# EAGLE design hamilton (EAGLE 7.6.0)
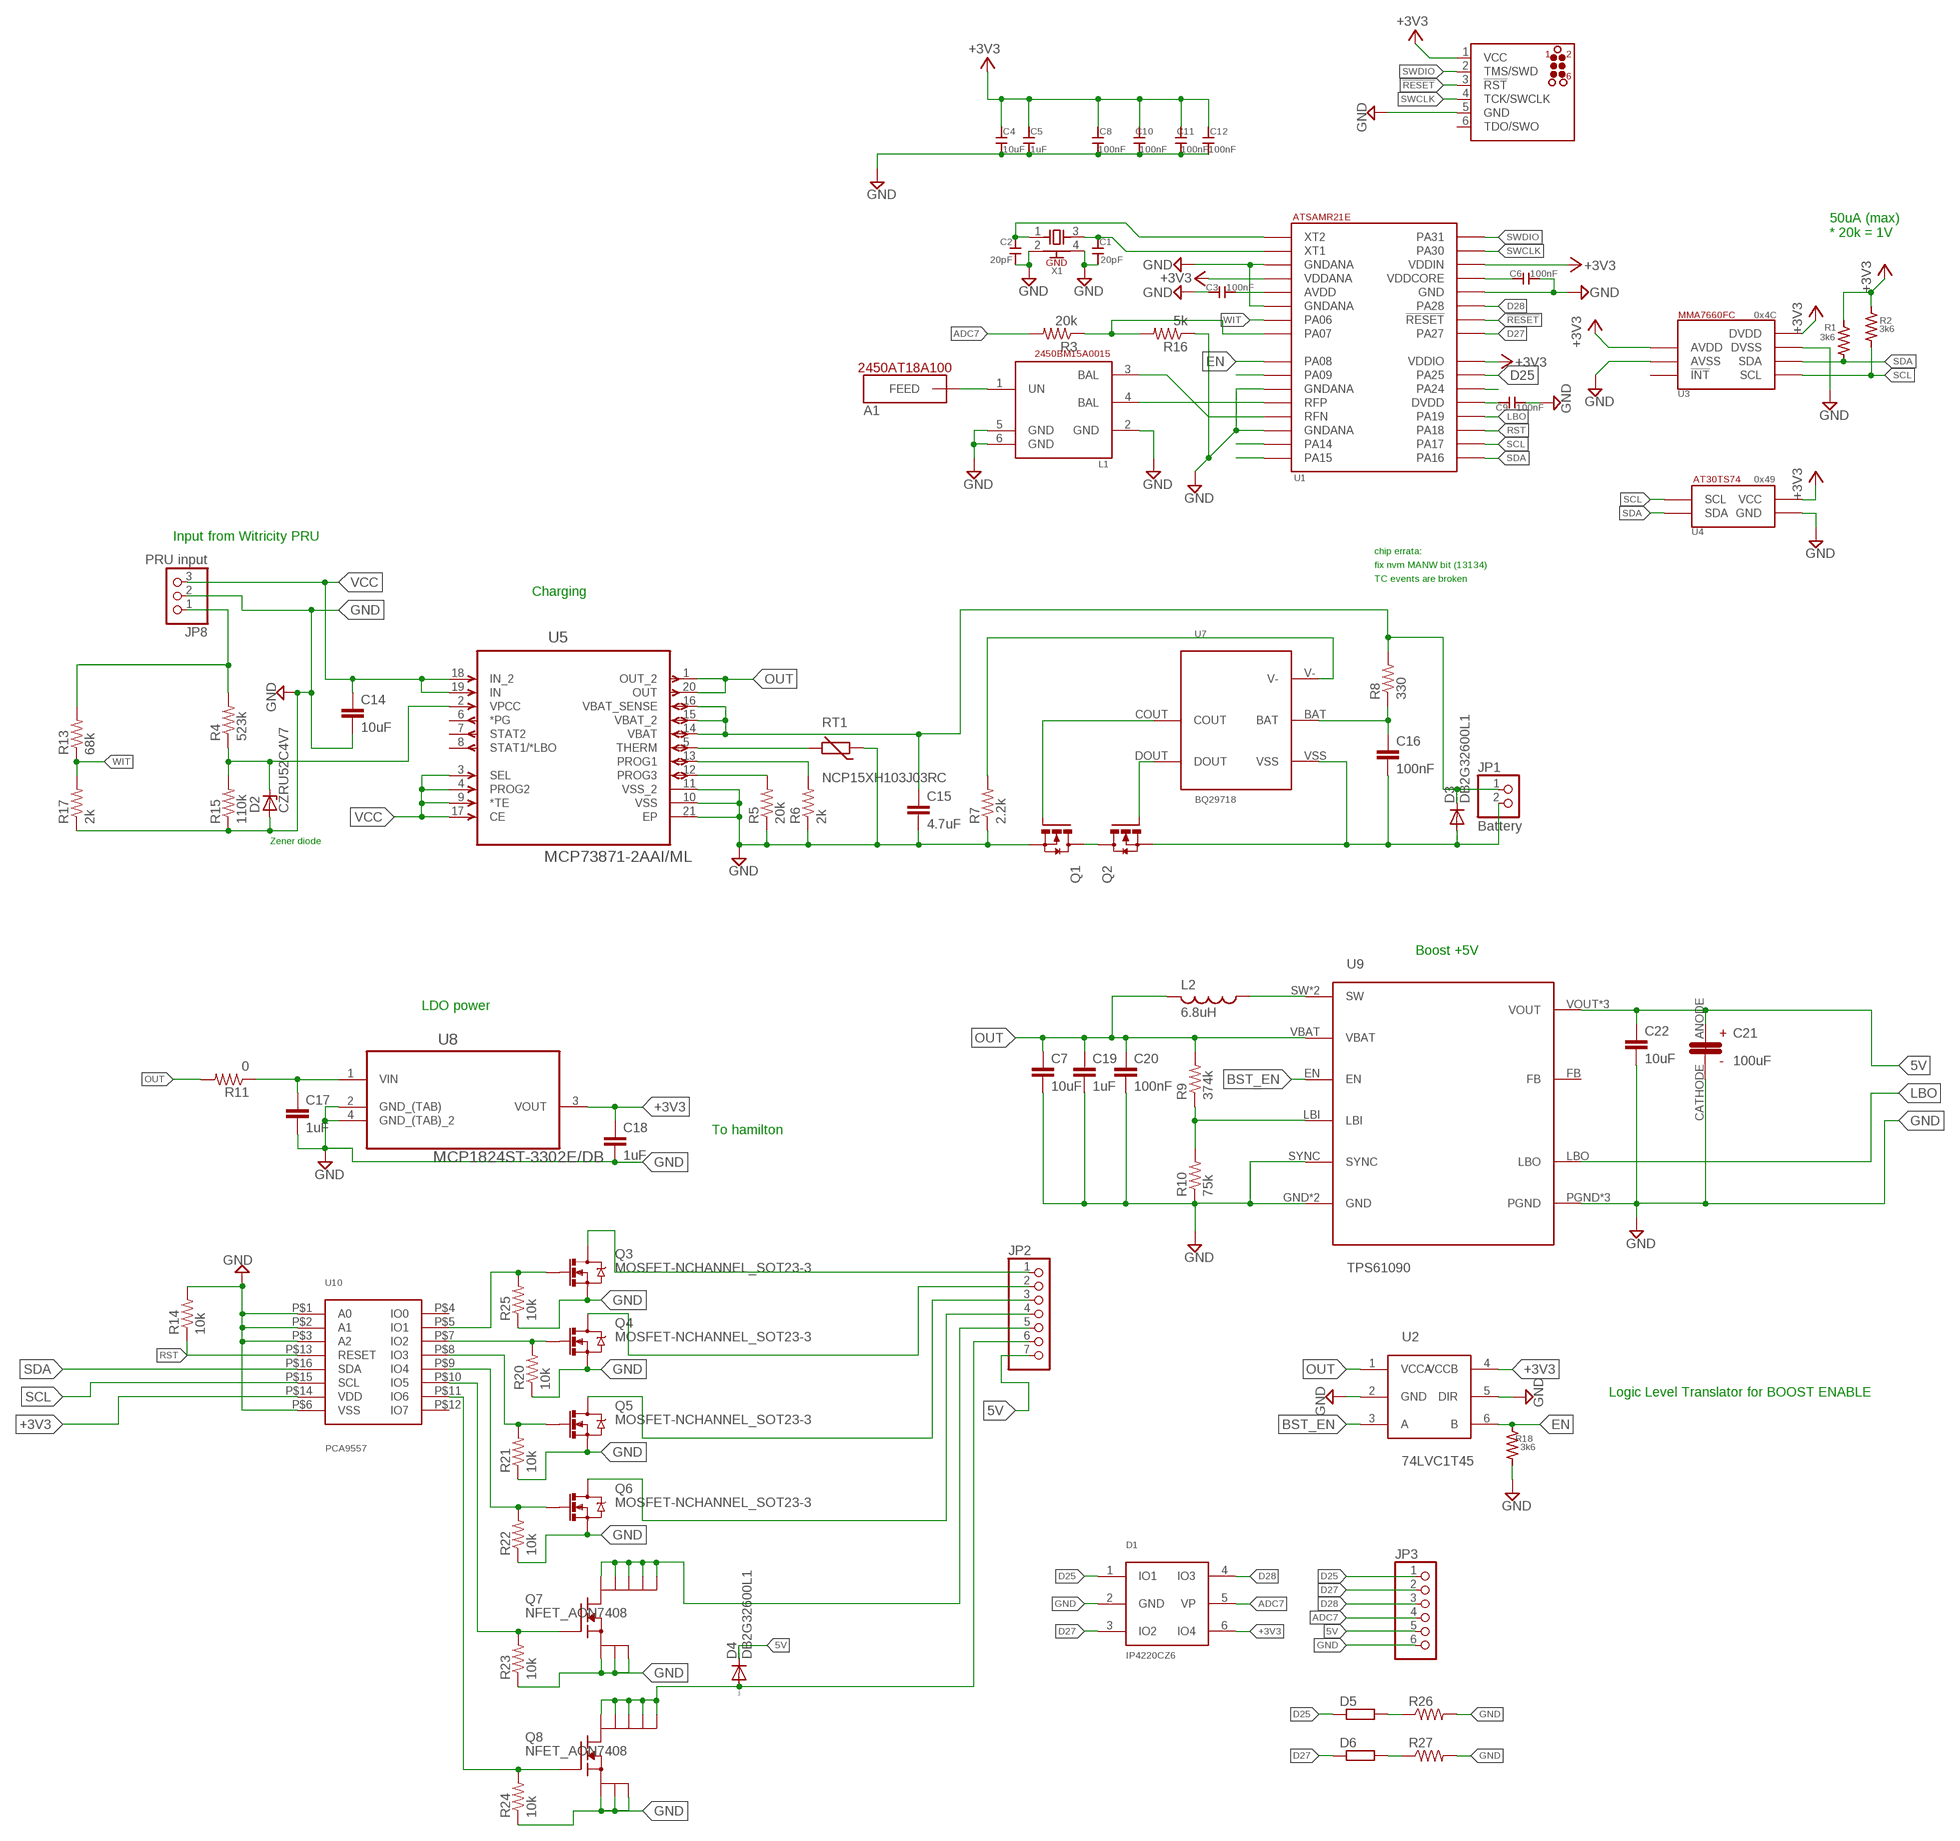
[diagram p0: schematic, sheet 1]

## Parts
A1  JOHANSON_ANTENNA2  [JOHANSON_ANTENNA2]
C1  20pF  0603_CAPACITORSMALL  [S0402]
C2  20pF  0603_CAPACITORSMALL  [S0402]
C3  100nF  0603_CAPACITOR0402  [C0402]
C4  10uF  0805_CAPACITOR  [0805]
C5  1uF  0603_CAPACITOR0402  [C0402]
C6  100nF  0603_CAPACITOR0402  [C0402]
C7  10uF  C-EUC0603  [C0603]
C8  100nF  0603_CAPACITOR0402  [C0402]
C9  100nF  0603_CAPACITOR0402  [C0402]
C10  100nF  0603_CAPACITOR0402  [C0402]
C11  100nF  0603_CAPACITOR0402  [C0402]
C12  100nF  0603_CAPACITOR0402  [C0402]
C14  10uF  C-EUC0603  [C0603]
C15  4.7uF  C-EUC0603  [C0603]
C16  100nF  C-EUC0603  [C0603]
C17  1uF  C-EUC0603  [C0603]
C18  1uF  C-EUC0603  [C0603]
C19  1uF  C-EUC0603  [C0603]
C20  100nF  C-EUC0603  [C0603]
C21  100uF  T491C686K010AT  [6032]
C22  10uF  C-EUC0603  [C0603]
D1  IP4220CZ6  [SOT457]
D2  CZRU52C4V7  [R0603]
D3  DB2G32600L1  [R0402]
D4  DB2G32600L1  [R0402]
D5  R-EU_R0603  [R0603]
D6  R-EU_R0603  [R0603]
JP1  Battery  PINHD-1X2  [1X02]
JP2  PINHD-1X7  [1X07]
JP3  PINHD-1X6  [1X06]
JP8  PRU input  PINHD-1X3  [1X03]
L1  BALUN_JOHANSON  [BALUN_JOHANSON]
L2  6.8uH  L-744787068  [2-SMD-7.8-7-5]
Q1  CSD16301Q2  [6-SMD]
Q2  CSD16301Q2  [6-SMD]
Q3  MOSFET-NCHANNEL_SOT23-3  [SOT23-3]
Q4  MOSFET-NCHANNEL_SOT23-3  [SOT23-3]
Q5  MOSFET-NCHANNEL_SOT23-3  [SOT23-3]
Q6  MOSFET-NCHANNEL_SOT23-3  [SOT23-3]
Q7  NFET_AON7408  [VDFN3X38L]
Q8  NFET_AON7408  [VDFN3X38L]
R1  3k6  0603_RESISTORSMALL  [S0402]
R2  3k6  0603_RESISTORSMALL  [S0402]
R3  20k  R-US_R0402  [R0402]
R4  523k  R-US_R0603  [R0603]
R5  20k  R-US_R0603  [R0603]
R6  2k  R-US_R0603  [R0603]
R7  2.2k  R-US_R0603  [R0603]
R8  330  R-US_R0603  [R0603]
R9  374k  R-US_R0603  [R0603]
R10  75k  R-US_R0603  [R0603]
R11  0  R-US_R0603  [R0603]
R13  68k  R-US_R0402  [R0402]
R14  10k  R-US_R0603  [R0603]
R15  110k  R-US_R0603  [R0603]
R16  5k  R-US_R0402  [R0402]
R17  2k  R-US_R0402  [R0402]
R18  3k6  0603_RESISTORSMALL  [S0402]
R20  10k  R-US_R0402  [R0402]
R21  10k  R-US_R0402  [R0402]
R22  10k  R-US_R0402  [R0402]
R23  10k  R-US_R0402  [R0402]
R24  10k  R-US_R0402  [R0402]
R25  10k  R-US_R0402  [R0402]
R26  R-US_R0402  [R0402]
R27  R-US_R0402  [R0402]
RT1  NCP15XH103J03RC  [CT/CN0402]
U1  SAMR21  [QFN32]
U2  74LVC1T45  [SOT891]
U3  MMA7660FC  [MMA7660]
U4  AT30TS74  [4WLCSP]
U5  MCP73871-2AAI/ML  [QFN50P400X400X100-21N]
U7  BQ29718  [6-WFDFN]
U8  MCP1824ST-3302E/DB  [SOT230P700X180-4N]
U9  TPS61090  [QFN-16]
U10  PCA9557  [SOT629-1]
U$1  JLINK_CONNECT  [TC2030-MCP-NL]
X1  XTAL  [XTAL]

## Nets
5V: C21.ANODE C22.1 D4.C JP2.7 JP3.5 U9.VOUT U9.VOUT_2(VOUT) U9.VOUT_3(VOUT)
!RESET!: U1.26(!RESET!) U$1.3(!RST!)
+3V3: C4.2 C5.2 C8.1 C10.1 C11.1 C12.1 C18.1 D1.6(IO4) R1.P$2 R2.P$2 U1.4(VDDANA) U1.24(VDDIO) U1.30(VDDIN) U2.4(VCCB) U3.3(AVDD) U3.9(DVDD) U4.A1(VCC) U8.3(VOUT) U10.P$14(VDD) U$1.1(VCC)
ADC7: D1.5(VP) JP3.4 R3.2
BST_EN: U2.3(A) U9.EN
D25: D1.1(IO1) D5.1 JP3.1 U1.23(PA25)
D27: D1.3(IO2) D6.1 JP3.2 U1.25(PA27)
D28: D1.4(IO3) JP3.3 U1.27(PA28)
EN: R18.P$2 U1.9(PA08) U2.6(B)
GND: C1.P$1 C2.P$1 C3.2 C4.1 C5.1 C6.1 C7.2 C8.2 C9.1 C10.2 C11.2 C12.2 C14.2 C15.2 C17.2 C18.2 C19.2 C20.2 C21.CATHODE C22.2 D1.2(GND) D2.A JP3.6 JP8.2 L1.2(GND) L1.5(GND) L1.6(GND) Q1.S_1(S) Q1.S_2(S) Q3.2(S) Q4.2(S) Q5.2(S) Q6.2(S) Q7.1(S) Q7.2(S) Q7.3(S) Q8.1(S) Q8.2(S) Q8.3(S) R5.1 R6.1 R7.1 R10.1 R14.2 R15.1 R16.1 R17.1 R18.P$1 R20.1 R21.1 R22.1 R23.1 R24.1 R25.1 R26.2 R27.2 RT1.1 U1.3(GNDANA) U1.6(GNDANA) U1.11(GNDANA) U1.14(GNDANA) U1.28(GND) U2.2(GND) U2.5(DIR) U3.4(AVSS) U3.8(DVSS) U4.A2(GND) U5.10(VSS) U5.11(VSS_2) U5.21(EP) U8.2(GND_(TAB)) U8.4(GND_(TAB)_2) U9.GND U9.P$17(GND) U9.PGND U9.PGND_2(PGND) U9.PGND_3(PGND) U9.SYNC U10.P$1(A0) U10.P$2(A1) U10.P$3(A2) U10.P$6(VSS) U$1.5(GND) X1.2(GND) X1.4(GND)
LBO: U1.20(PA19) U9.LBO
LDOIN: C17.1 R11.1 U8.1(VIN)
N$1: JP8.1 R4.2 R13.2
N$2: L1.3(BAL) U1.13(RFN)
N$3: A1.FEED L1.1(UN)
N$4: C2.P$2 U1.1(XT2) X1.1(X1)
N$5: C6.2 U1.29(VDDCORE)
N$6: C3.1 U1.5(AVDD)
N$7: C1.P$2 U1.2(XT1) X1.3(X2)
N$9: R3.1 R16.2 U1.8(PA07)
N$10: C9.2 U1.21(DVDD)
N$11: JP2.5 Q7.5(D) Q7.6(D) Q7.7(D) Q7.8(D) Q7.PAD(D)
N$12: U1.10(PA09)
N$13: L1.4(BAL) U1.12(RFP)
N$14: JP2.1 Q3.3(D)
N$15: U1.15(PA14)
N$16: R5.2 U5.12(PROG3)
N$17: U1.16(PA15)
N$18: R6.2 U5.13(PROG1)
N$19: RT1.2 U5.5(THERM)
N$20: R7.2 U7.V-
N$21: C16.1 R8.1 U7.BAT
N$22: Q1.G U7.COUT
N$23: Q2.G U7.DOUT
N$24: Q1.D_1(D) Q1.D_2(D) Q1.D_3(D) Q1.D_4(D) Q1.D_5(D) Q2.D_1(D) Q2.D_2(D) Q2.D_3(D) Q2.D_4(D) Q2.D_5(D)
N$25: C16.2 D3.A JP1.2 Q2.S_1(S) Q2.S_2(S) U7.VSS
N$26: D4.A JP2.6 Q8.5(D) Q8.6(D) Q8.7(D) Q8.8(D) Q8.PAD(D)
N$27: L2.P$1 U9.SW U9.SW_2(SW)
N$28: R9.1 R10.2 U9.LBI
N$30: Q3.1(G) R25.2 U10.P$5(IO1)
N$31: Q4.1(G) R20.2 U10.P$7(IO2)
N$32: Q5.1(G) R21.2 U10.P$8(IO3)
N$33: Q6.1(G) R22.2 U10.P$9(IO4)
N$34: JP2.2 Q4.3(D)
N$35: JP2.3 Q5.3(D)
N$36: JP2.4 Q6.3(D)
N$37: C15.1 D3.C JP1.1 R8.2 U5.14(VBAT) U5.15(VBAT_2) U5.16(VBAT_SENSE)
N$38: D5.2 R26.1
N$39: D6.2 R27.1
N$40: Q7.4(G) R23.2 U10.P$10(IO5)
N$41: Q8.4(G) R24.2 U10.P$11(IO6)
N$42: U1.22(PA24)
OUT: C7.1 C19.1 C20.1 L2.P$2 R9.2 R11.2 U2.1(VCCA) U5.1(OUT_2) U5.20(OUT) U9.VBAT
RECT: D2.C R4.1 R15.2 U5.2(VPCC)
RST: R14.1 U1.19(PA18) U10.P$13(RESET)
SCL: R2.P$1 U1.18(PA17) U3.6(SCL) U4.B2(SCL) U10.P$15(SCL)
SDA: R1.P$1 U1.17(PA16) U3.7(SDA) U4.B1(SDA) U10.P$16(SDA)
SWCLK: U1.31(PA30) U$1.4(TCK/SWCLK)
SWDIO: U1.32(PA31) U$1.2(TMS/SWD)
VCC: C14.1 JP8.3 U5.3(SEL) U5.4(PROG2) U5.9(*TE) U5.17(CE) U5.18(IN_2) U5.19(IN)
WIT: R13.1 R17.2 U1.7(PA06)
Unconnected: U3.5(!INT!) U5.6(*PG) U5.7(STAT2) U5.8(STAT1/*LBO) U9.FB U10.P$4(IO0) U10.P$12(IO7) U$1.6(TDO/SWO)

## Notes on the sheet
- 50uA (max) 
  * 20k = 1V
- X1
- 0x4C
- 0x49
- Input from Witricity PRU
- chip errata:
- fix nvm MANW bit (13134)
- TC events are broken
- Charging
- Zener diode
- Boost +5V
- LDO power
- To hamilton
- Logic Level Translator for BOOST ENABLE

## Library data of the parts
A1 = storm:JOHANSON_ANTENNA2
C1-C3 C5 C6 C8-C12 = storm:0603_CAPACITOR
C4 = storm:0805_CAPACITOR
C7 C14-C20 C22 = resistor:C-EU: CAPACITOR, European symbol
C21 = insole:T491C686K010AT
D1 = insole:IP4220CZ6
D2 = insole:CZRU52C4V7
D3 D4 = insole:DB2G32600L1
D5 D6 = resistor:R-EU_: RESISTOR, European symbol
JP1 = pinhead:PINHD-1X2: PIN HEADER
JP2 = pinhead:PINHD-1X7: PIN HEADER
JP3 = pinhead:PINHD-1X6: PIN HEADER
JP8 = pinhead:PINHD-1X3: PIN HEADER
L1 = storm:BALUN_JOHANSON
L2 = insole:L-744787068
Q1 Q2 = insole:CSD16301Q2
Q3-Q6 = Simplex-DiscreteSemi:MOSFET-NCHANNEL: Generic N-channel mosfet
Q7 Q8 = fets:NFET_AON7408
R1 R2 R18 = storm:0603_RESISTOR
R3-R11 R13-R17 R20-R27 = resistor:R-US_: RESISTOR, American symbol
RT1 = varistor:NCP15XH103J03RC
U1 = storm:SAMR21
U2 = insole:74LVC1T45
U3 = storm:MMA7660FC
U4 = storm:AT30TS74
U5 = Microchip_By_element14_Batch_1:MCP73871-2AAI/ML: IC, BATTERY CHARGER, 1A; MPN: MCP73871-2AAI/ML; OC_FARNELL: 1642487; OC_NEWARK: 54M4955; PACKAGE: QFN-20; SUPPLIER: Microchip
U7 = insole:BQ29718
U8 = Microchip_By_element14_Batch_1:MCP1824ST-3302E/DB: IC, LDO VOLT REG, 3.3V, 0.3A,; MPN: MCP1824ST-3302E/DB; OC_FARNELL: 1578379; OC_NEWARK: 05N1293; PACKAGE: SOT-223-3; SUPPLIER: Microchip
U9 = insole:TPS61090
U10 = insole:PCA9557
U$1 = storm:JLINK_CONNECT
X1 = storm:XTAL

## Board
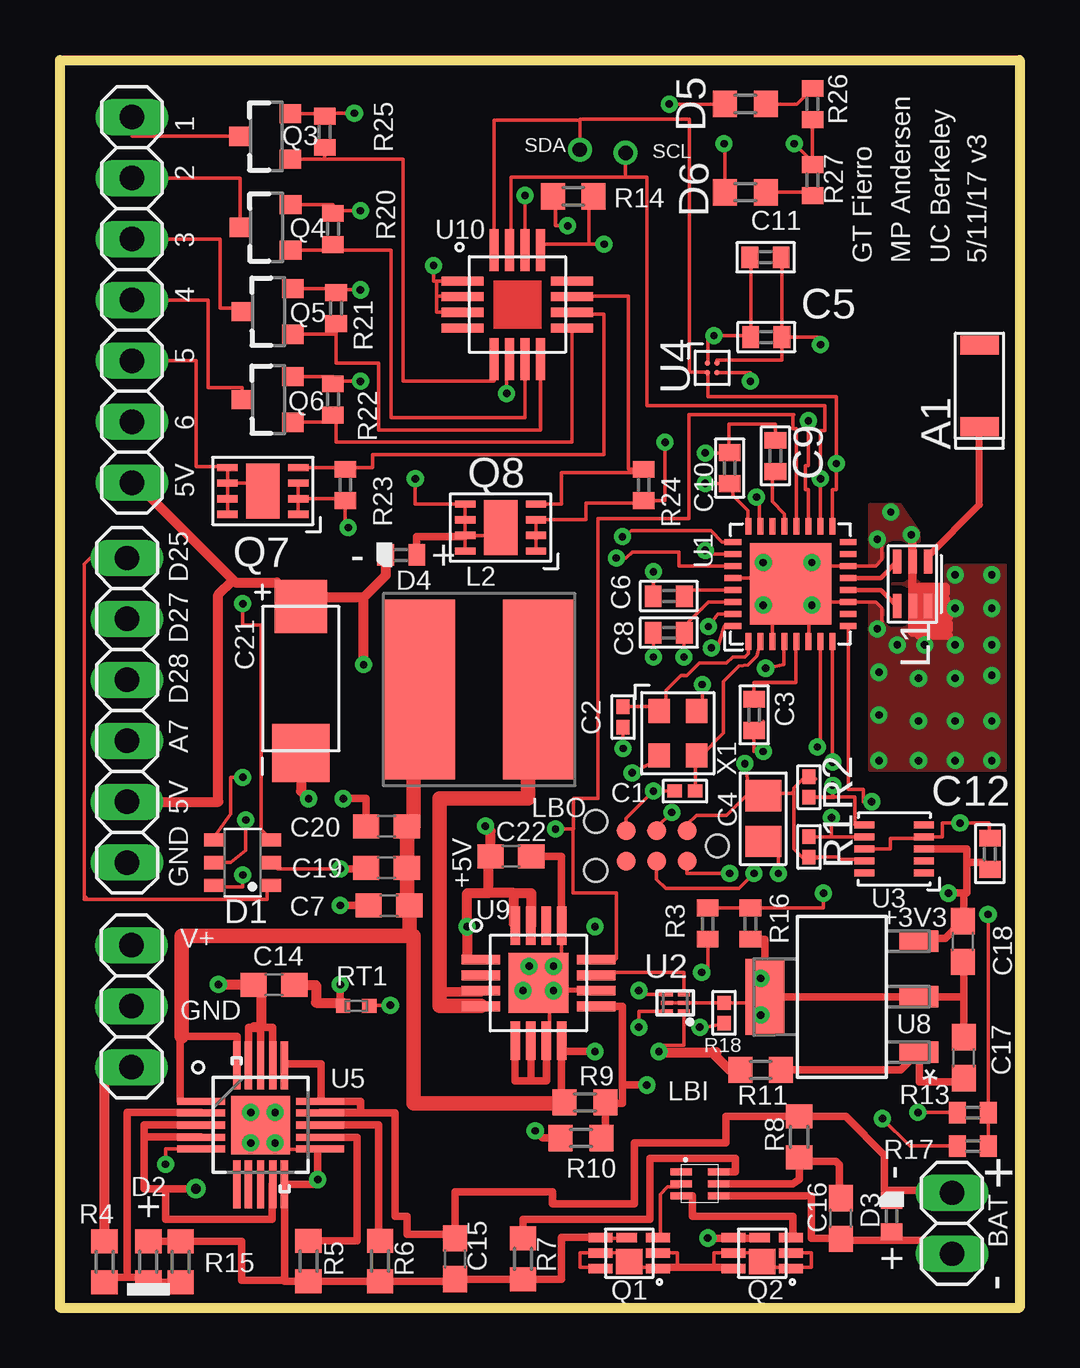
[diagram p1: board, top side]
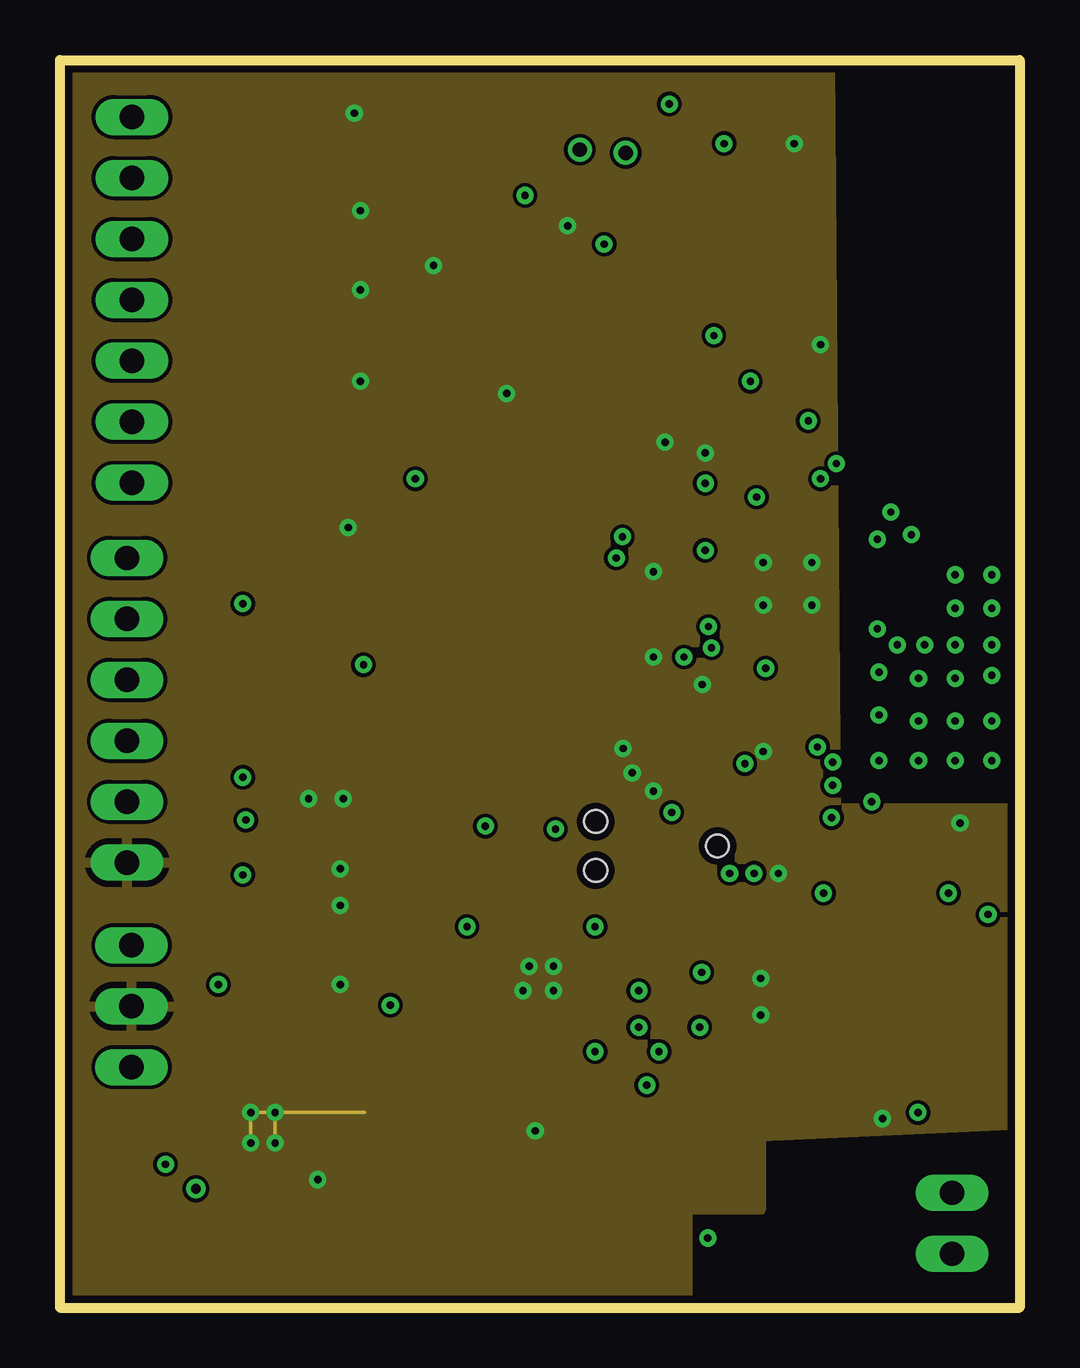
[diagram p2: board, inner layer Route2]
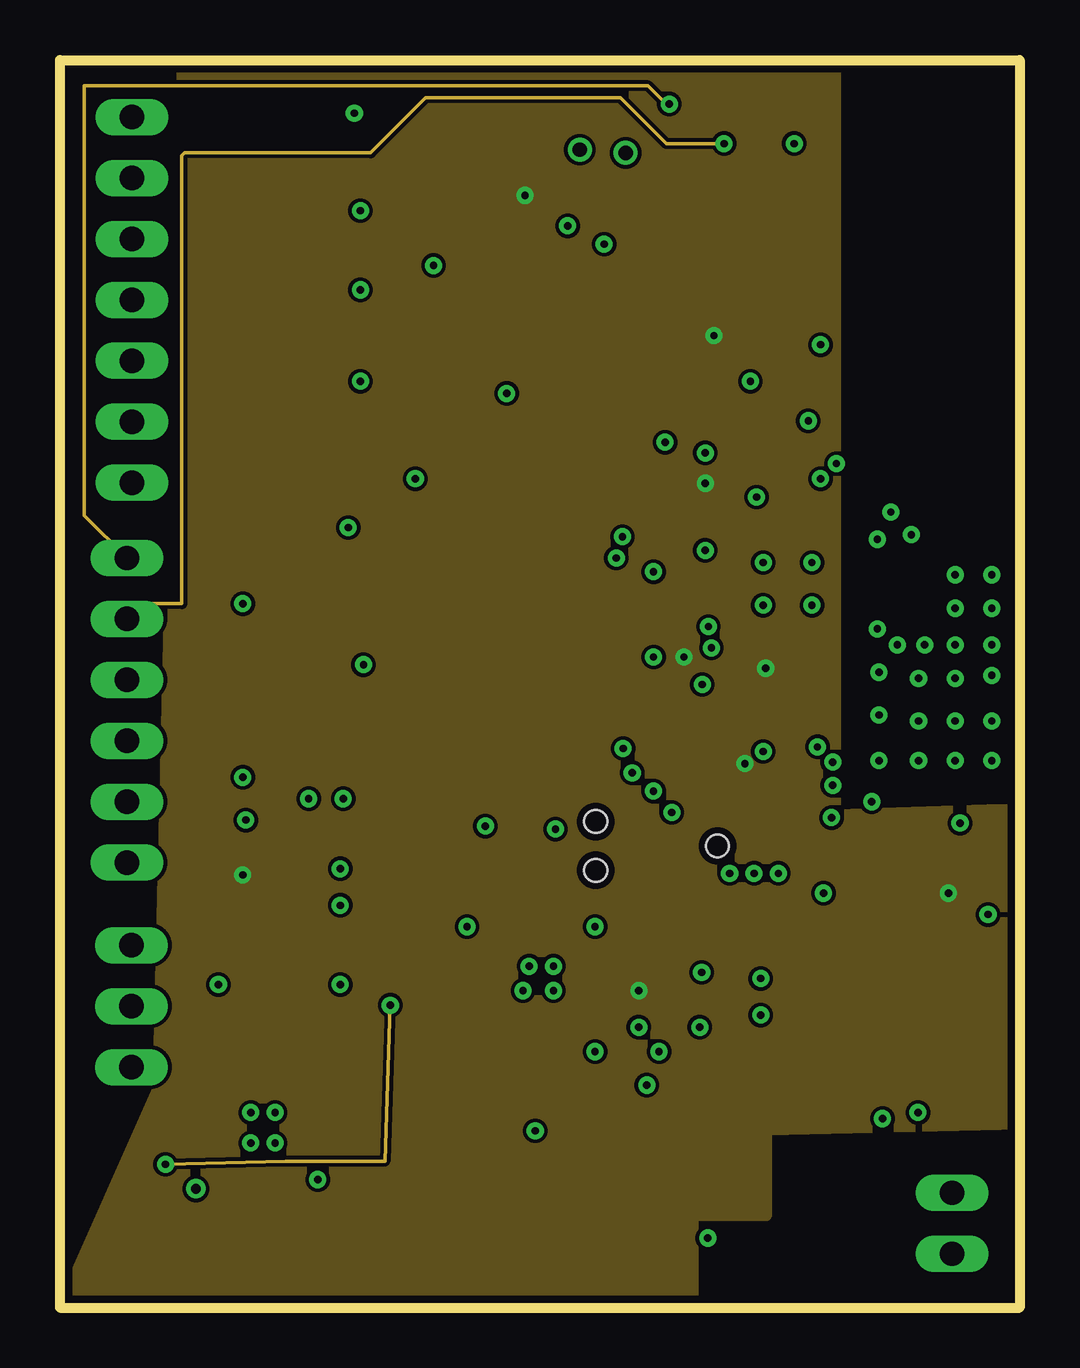
[diagram p3: board, inner layer Route15]
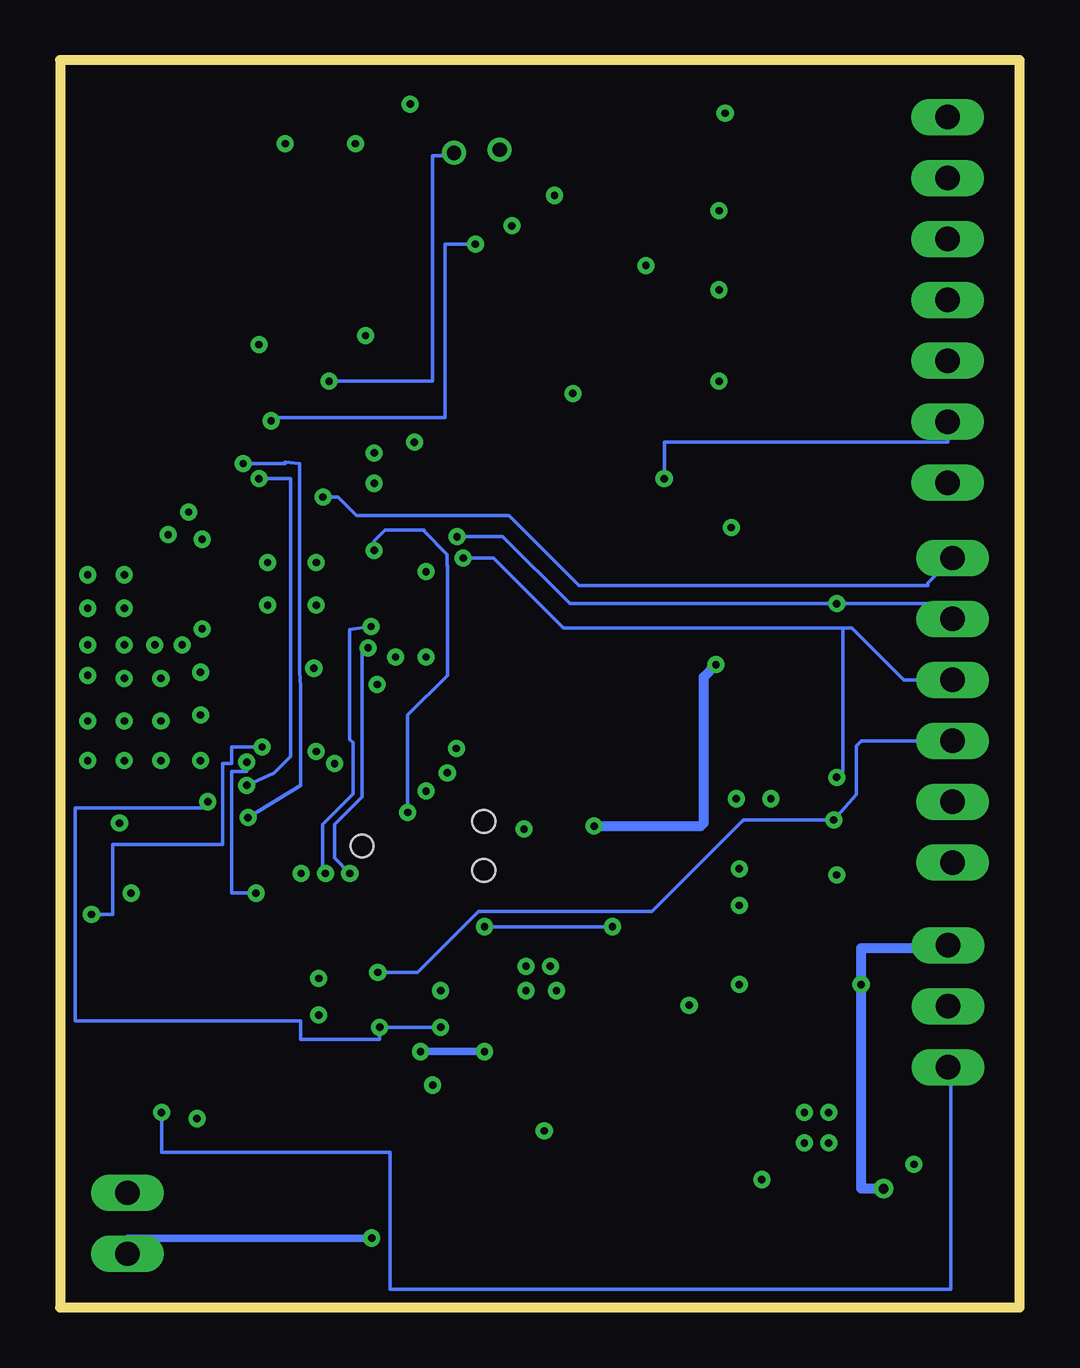
[diagram p4: board, bottom side, seen from below]

Size 40 x 52 mm. Coordinates in mm from the lower left corner, seen from the top.
Outline: 0,0 40,0 40,52 0,52 0,0
Copper layers (1*2*15*16): Top 0.035mm / dielectric 1.5mm / Route2 0.035mm / dielectric 0.15mm / Route15 0.035mm / dielectric 0.2mm / Bottom 0.035mm
Design rules "default *": minimum track width 6mil, minimum drill 12mil, track to track 6mil, track to pad 6mil, pad to pad 6mil, via to via 6mil, smd to smd 6mil, copper to edge 12mil, drill to drill 8mil, minimum pad ring 10mil, minimum via ring 8mil, stop-mask expansion 4mil, vias tented up to drill 12mil, thermal gap 10mil

### Footprints (pad centres in the part's own frame; a part is rotated, then mirrored left to right if it is on the bottom)
JOHANSON_ANTENNA2 = smd 0.8 x 1.6: FEED -1.7,0; NC 1.7,0
S0402 = smd 0.6 x 0.55: P$1 0,0; P$2 0.85,0
C0402 = smd 0.7 x 0.9: 1 -0.65,0; 2 0.65,0
0805 = smd 1.3 x 1.5: 1 -0.95,0; 2 0.95,0
C0603 = smd 1.1 x 1: 1 -0.85,0; 2 0.85,0
6032 = smd 2.2 x 2.2: ANODE 3,0 | smd 2.4 x 2.4: CATHODE -3.1,0
SOT457 = smd 0.55 x 0.8: 1 -0.95,-1.2; 2 0,-1.2; 3 0.95,-1.2; 4 0.95,1.2; 5 0,1.2; 6 -0.95,1.2
R0603 = smd 1 x 1.1: A 0.85,0; C -0.85,0
R0402 = smd 0.7 x 0.9: A -0.65,0; C 0.65,0
R0603' = smd 1 x 1.1: 1 -0.85,0; 2 0.85,0
1X02 = drill 1.016 long: 1 -1.27,0; 2 1.27,0
1X07 = drill 1.016 long: 1 -7.62,0; 2 -5.08,0; 3 -2.54,0; 4 0,0; 5 2.54,0; 6 5.08,0; 7 7.62,0
1X06 = drill 1.016 long: 1 -6.35,0; 2 -3.81,0; 3 -1.27,0; 4 1.27,0; 5 3.81,0; 6 6.35,0
1X03 = drill 1.016 long: 1 -2.54,0; 2 0,0; 3 2.54,0
BALUN_JOHANSON = smd 1 x 0.35: 1 -0.925,0.65; 2 -0.925,0; 3 -0.925,-0.65; 4 0.925,-0.65; 5 0.925,0; 6 0.925,0.65
2-SMD-7.8-7-5 = smd 7.5 x 3: P$1 0,2.5; P$2 0,-2.5
6-SMD = smd 0.4 x 1: D_1 -0.65,-1.2; D_2 0,-1.2; D_3 0,1.2; D_4 -0.65,1.2; G 0.65,-1.2; S_1 0.65,1.2 | smd 1.05 x 1.1: D_5 -0.35,0 | smd 0.4 x 0.85: S_2 0.65,0.1
SOT23-3 = smd 0.8 x 0.9: 1 -0.95,-1; 2 0.95,-1; 3 0,1.1
VDFN3X38L = smd 0.3 x 0.85: 1 -0.975,-1.475; 2 -0.325,-1.475; 3 0.325,-1.475; 4 0.975,-1.475; 5 0.975,1.475; 6 0.325,1.475; 7 -0.325,1.475; 8 -0.975,1.475 | smd 2.3 x 1.4: PAD 0,0
R0402' = smd 0.7 x 0.9: 1 -0.65,0; 2 0.65,0
CT/CN0402 = smd 0.6 x 0.6: 1 -0.55,0; 2 0.55,0
QFN32 = smd 0.7 x 0.25: 1 -2.4,1.75; 2 -2.4,1.25; 3 -2.4,0.75; 4 -2.4,0.25; 5 -2.4,-0.25; 6 -2.4,-0.75; 7 -2.4,-1.25; 8 -2.4,-1.75; 17 2.4,-1.75; 18 2.4,-1.25; 19 2.4,-0.75; 20 2.4,-0.25; 21 2.4,0.25; 22 2.4,0.75; 23 2.4,1.25; 24 2.4,1.75 | smd 0.25 x 0.7: 9 -1.75,-2.4; 10 -1.25,-2.4; 11 -0.75,-2.4; 12 -0.25,-2.4; 13 0.25,-2.4; 14 0.75,-2.4; 15 1.25,-2.4; 16 1.75,-2.4; 25 1.75,2.4; 26 1.25,2.4; 27 0.75,2.4; 28 0.25,2.4; 29 -0.25,2.4; 30 -0.75,2.4; 31 -1.25,2.4; 32 -1.75,2.4 | smd 3.4 x 3.4: PAD 0,0
SOT891 = smd 0.15 x 0.5: 1 -0.35,-0.35; 2 0,-0.35; 3 0.35,-0.35; 4 0.35,0.35; 5 0,0.35; 6 -0.35,0.35
MMA7660 = smd 0.3 x 0.825: 1 -1,-1.24; 2 -0.5,-1.24; 3 0,-1.24; 4 0.5,-1.24; 5 1,-1.24; 6 1,1.24; 7 0.5,1.24; 8 0,1.24; 9 -0.5,1.24; 10 -1,1.24
4WLCSP = smd 0.235 x 0.235: A1 -0.2,0.2; A2 0.2,0.2; B1 -0.2,-0.2; B2 0.2,-0.2
QFN50P400X400X100-21N = smd 2 x 0.3: 1 -2.48,0.991; 2 -2.48,0.508; 3 -2.48,0; 4 -2.48,-0.508; 5 -2.48,-0.991; 11 2.48,-0.991; 12 2.48,-0.508; 13 2.48,0; 14 2.48,0.508; 15 2.48,0.991 | smd 0.3 x 2: 6 -0.991,-2.48; 7 -0.508,-2.48; 8 0,-2.48; 9 0.508,-2.48; 10 0.991,-2.48; 16 0.991,2.48; 17 0.508,2.48; 18 0,2.48; 19 -0.508,2.48; 20 -0.991,2.48 | smd 2.443 x 2.443: 21 0,0
6-WFDFN = smd 0.9 x 0.28: BAT 0.78,0; COUT -0.78,0; DOUT -0.78,-0.5; NC -0.78,0.5; V- 0.78,0.5; VSS 0.78,-0.5
SOT230P700X180-4N = smd 1.626 x 0.889: 1 -3.2,2.311; 2 -3.2,0; 3 -3.2,-2.311 | smd 1.626 x 3.175: 4 3.2,0
QFN-16 = smd 1.6 x 0.4: EN 2.4,0.32; LBI 2.4,-0.97; LBO 2.4,0.97; NC -2.4,0.32; SW -2.4,-0.97; SW_2 -2.4,-0.32; SYNC 2.4,-0.32; VOUT_3 -2.4,0.97 | smd 0.4 x 1.6: FB 0.32,2.4; GND 0.97,2.4; PGND 0.32,-2.4; PGND_2 -0.32,-2.4; PGND_3 -0.97,-2.4; VBAT 0.97,-2.4; VOUT -0.97,2.4; VOUT_2 -0.32,2.4 | smd 2.5 x 2.5: P$17 0,0
SOT629-1 = smd 1.75 x 0.38: P$1 -2.275,0.975; P$2 -2.275,0.325; P$3 -2.275,-0.325; P$4 -2.275,-0.975; P$9 2.275,-0.975; P$10 2.275,-0.325; P$11 2.275,0.325; P$12 2.275,0.975 | smd 0.38 x 1.75: P$5 -0.975,-2.275; P$6 -0.325,-2.275; P$7 0.325,-2.275; P$8 0.975,-2.275; P$13 0.975,2.275; P$14 0.325,2.275; P$15 -0.325,2.275; P$16 -0.975,2.275
TC2030-MCP-NL = smd 0.787 x 0.787: 1 1.27,-0.635; 2 1.27,0.635; 3 2.54,-0.635; 4 2.54,0.635; 5 3.81,-0.635; 6 3.81,0.635 | hole 0.95: 0,0; 5.08,-1.016; 5.08,1.016
XTAL = smd 1 x 0.9: 1 -0.925,-0.775; 2 0.925,-0.775; 3 0.925,0.775; 4 -0.925,0.775

### Placement (x,y rotation side)
A1  38.33,38.42 90 top
C1  25.63,21.53 0 top
C2  23.47,24.19 90 top
C3  28.93,24.7 270 top
C4  29.32,20.38 90 top
C5  29.44,40.45 180 top
C6  25.38,29.65 0 top
C7  13.72,16.76 180 top
C8  25.38,28.13 180 top
C9  29.82,35.5 270 top
C10  27.92,34.99 90 top
C11  29.42,43.78 0 top
C12  38.76,18.91 90 top
C14  8.92,13.44 0 top
C15  16.46,2.04 270 top
C16  32.54,3.71 270 top
C17  37.67,10.41 90 top
C18  37.63,15.26 270 top
C19  13.61,18.33 180 top
C20  13.61,20.06 180 top
C21  10.05,26.22 90 top
C22  18.8,18.81 0 top
D1  7.62,18.54 90 top
D2  3.68,1.91 90 top
D3  34.67,3.81 90 top
D4  14.22,31.37 180 top
D5  [R0603']  28.57,50.16 0 top
D6  [R0603']  28.57,46.48 0 top
JP1  37.18,3.51 270 top
JP2  3,42 270 top
JP3  2.79,24.89 270 top
JP8  2.98,12.56 90 top
L1  35.54,30.16 270 top
L2  17.47,25.76 270 top
Q1  23.73,2.27 90 top
Q2  29.27,2.27 90 top
Q3  8.6,48.81 90 top
Q4  8.62,45.02 90 top
Q5  8.7,41.51 90 top
Q6  8.7,37.85 90 top
Q7  8.46,34.04 90 top
Q8  18.37,32.51 90 top
R1  31.22,19.62 270 top
R2  31.22,21.27 90 top
R3  20k  [R0402']  27,16 270 top
R4  523k  [R0603']  1.86,1.91 90 top
R5  20k  [R0603']  10.36,1.94 90 top
R6  2k  [R0603']  13.34,1.94 90 top
R7  2.2k  [R0603']  19.3,2.03 90 top
R8  330  [R0603']  30.81,7.11 90 top
R9  374k  [R0603']  21.89,8.55 180 top
R10  75k  [R0603']  21.72,7.07 0 top
R11  0  [R0603']  29.21,9.91 180 top
R13  68k  [R0402']  38.05,8.13 180 top
R14  10k  [R0603']  21.39,46.31 180 top
R15  110k  [R0603']  5.03,1.91 270 top
R16  5k  [R0402']  28.78,16 90 top
R17  2k  [R0402']  38.05,6.73 0 top
R18  27.69,12.7 270 top
R20  10k  [R0402']  11.38,44.96 270 top
R21  10k  [R0402']  11.51,41.66 270 top
R22  10k  [R0402']  11.38,37.85 270 top
R23  10k  [R0402']  11.89,34.29 90 top
R24  10k  [R0402']  24.34,34.29 90 top
R25  10k  [R0402']  11.03,49.01 270 top
R26  [R0402']  31.37,50.16 270 top
R27  [R0402']  31.37,46.99 90 top
RT1  12.35,12.57 0 top
U1  30.46,30.16 90 top
U2  25.65,12.7 90 top
U3  34.78,19.11 90 top
U4  27.19,39.17 0 top
U5  8.37,7.61 0 top
U7  26.67,5.16 0 top
U8  32.59,12.95 180 top
U9  19.95,13.52 0 top
U10  19.06,41.8 0 top
U$1  27.41,19.24 180 top
X1  25.76,23.94 270 top

### Tracks (layer width: path | path; a pad name or v marks a point on that pad's centre or on a via)
5V  (via drill 0.3)
  Top 0.152: 17.86,18.75 C22.1 17.86,18.81 | 18.93,16 U9.VOUT | U9.VOUT_2 | 16.97,14.49 U9.VOUT_3
  Top 0.406: JP2.7 3.17,34.38 7.21,30.33 | 7.21,30.33 7.32,30.23 9.04,30.23 C21.ANODE 10.42,29.59 12.65,29.59 | C22.1 17.95,19.85 v17.73,20.07 | v12.65,26.8 12.65,29.59 | 18.93,16 18.93,17.27 | 18.93,17.27 19.64,17.27 U9.VOUT_2 | 18.93,17.27 17.86,17.27 | 17.86,17.27 17.86,18.81 | 16.97,14.49 v16.97,15.88 16.97,17.27 17.86,17.27 | JP3.5 6.6,21.08 6.6,29.72 7.21,30.33 | D4.C 13.57,30.51 12.65,29.59
  Bottom 0.152: v22.3,15.88 v16.97,15.88
  Bottom 0.406: v17.73,20.07 13.29,20.07 13.16,20.19 13.16,26.29 v12.65,26.8
!RESET!  (via drill 0.3)
  Top 0.152: U1.26 27.05,31.41 v26.9,31.56 | v25.5,20.64 24.87,20 U$1.3
  Bottom 0.152: 23.85,30.92 23.85,26.35 25.5,24.7 v25.5,20.64 | 23.85,30.92 | 23.85,30.92 23.85,31.39 24.82,32.36 24.82,32.41 26.45,32.41 26.9,31.95 v26.9,31.56
+3V3  (via drill 0.3)
  Top 0.152: U1.24 28.68,32.59 28.68,33.21 28.05,33.84 28.05,34.21 27.93,34.32 27.93,34.34 C10.1 | 29.41,21.43 29.44,21.46 | R2.P$2 31.51,22.03 30.97,22.03 30.59,21.65 30.59,21.53 | 30.59,21.53 30.49,21.43 29.41,21.43 | 30.59,21.53 30.59,19.11 30.97,18.73 31.69,18.73 R1.P$2 32.47,18.77 32.47,18.67 33.54,18.67 U3.9 | 26.03,28.4 26.08,28.45 | 26.08,28.45 27.03,29.4 28.05,29.4 U1.30 | U$1.1 26.14,20.13 26.52,20.51 27.79,20.51 28.55,21.27 28.93,21.27 | 28.93,21.27 29.19,21.27 | 29.19,21.27 29.25,21.27 | v28.55,22.67 28.68,21.91 28.93,21.65 28.93,21.27 | v26.01,27.11 26.01,27.88 26.03,27.89 C8.1 26.03,28.27 26.14,28.38 26.08,28.45 | C10.1 27.9,34.35 v26.9,34.35 | 29.41,21.43 C4.2 29.25,21.33 29.19,21.27 | 37.67,16.15 C18.1 37.52,16 | 27.92,34.29 C10.1 | C12.1 38.48,18.54 | 19.41,44.1 U10.P$14 v19.38,46.35 19.38,46.31 | U4.A1 27,39.37 27,40.51 v27.26,40.51 28.79,40.51 C5.2 28.79,43.78 C11.1 | U1.4 30.18,27.76 30.18,26.8 v29.42,26.64 | U2.4 24.29,13.05 v24.13,13.21 | 6.35,17.52 D1.6 6.49,17.53 7.62,17.53 v7.62,18.03
  Top 0.305: 37.8,18.54 37.8,19.11 U3.3 | 37.52,16 36.91,15.39 35.92,15.39 U8.3 | 38.48,18.54 37.8,18.54 | 37.67,16.15 37.67,17.27 | 37.67,17.27 v37.04,17.27 | 37.67,17.27 37.8,17.27 37.8,18.54
  pour Route15: 0,0 4.06,9.14 5.08,51.69 32.34,51.82 32.34,20.57 39.88,20.83 40.13,7.62 29.46,7.37 29.46,3.81 26.42,3.81 26.42,0
ADC7  (via drill 0.3)
  Top 0.152: R3.2 27,13.97 v26.75,13.97 | D1.5 7.11,18.54 7.75,19.05 v7.75,20.32
  Bottom 0.152: v26.75,13.97 25.1,13.97 22.56,16.51 15.32,16.51 11.51,20.32 v7.75,20.32 6.81,21.38 6.81,23.41 6.6,23.62 JP3.4
BST_EN
  Top 0.152: U9.EN 22.35,13.97 26,13.97 U2.3
D25  (via drill 0.3)
  Top 0.152: U1.23 29.16,32.56 29.16,33.66 29.04,33.66 v29.04,33.78 | 1.09,17.09 1.02,17.02 | 1.02,17.02 1.02,30.99 1.27,31.24 JP3.1 | D1.1 8.64,17.41 8.64,17.02 1.02,17.02 | 27.3,50.16 D5.1 v25.4,50.16
  Route15 0.152: v25.4,50.16 25.27,50.16 24.51,50.93 1.02,50.93 1.02,33.02 JP3.1
  Bottom 0.152: v29.04,33.78 28.4,33.78 27.64,33.02 21.29,33.02 18.37,30.1 3.83,30.1 3.83,30.21 JP3.1
D27  (via drill 0.3)
  Top 0.152: U1.25 27.6,31.91 27.13,32.38 23.83,32.38 v23.45,32.13 | D1.3 8.38,19.93 8.38,28.45 7.62,28.45 v7.62,29.34 | D6.1 27.73,48.48 v27.69,48.51
  Route15 0.152: 23.37,32.21 v23.45,32.13 | v27.69,48.51 25.27,48.51 23.37,50.42 15.24,50.42 12.95,48.13 5.21,48.13 5.08,48.01 5.08,29.34 3.43,29.34 JP3.2
  Bottom 0.152: v23.45,32.13 21.54,32.13 18.75,29.34 v7.62,29.34 3.43,29.34 JP3.2
D28  (via drill 0.3)
  Top 0.152: U1.27 25.81,30.91 25.81,31.5 23.85,31.5 23.6,31.24 v23.19,31.24 | D1.4 6.49,19.56 6.49,19.69 7.11,20.57 7.11,22.1 v7.62,22.1
  Bottom 0.152: v23.19,31.24 21.92,31.24 19,28.32 7.37,28.32 | 7.37,28.32 6.99,28.32 4.83,26.16 JP3.3 | v7.62,22.1 7.37,22.35 7.37,28.32
EN  (via drill 0.3)
  Top 0.152: v33.84,21.08 33.48,21.08 33.48,21.59 32.86,21.59 U1.9 | v26.67,11.68 26.92,11.68 R18.P$2 | U2.6 24.13,12.35 v24.13,11.68
  Bottom 0.152: v33.84,21.08 33.84,20.83 39.37,20.83 39.37,11.94 29.97,11.94 29.97,11.18 26.67,11.18 v26.67,11.68 v24.13,11.68
GND  (via drill 0.3)
  Top 0.152: 34.27,32.07 34.27,31.18 34,30.91 U1.14 31.87,30.91 31.73,31.05 v31.35,31.05 | 34.27,28.38 34.27,29.15 34,29.41 32.11,29.4 31.86,29.53 31.97,29.41 U1.11 | C8.2 24.73,27.89 24.74,27.88 v24.74,27.11 | C6.1 24.74,29.91 v24.74,30.67 | X1.4 26.53,25.08 | 26.53,25.08 26.53,25.2 26.52,25.21 | X1.2 24.96,23.01 24.62,22.67 v23.85,22.29 | C2.P$1 v23.47,23.3 | C1.P$1 v24.74,21.53 23.6,20.38 U$1.5 23.5,19.81 | v26.77,25.97 26.77,25.21 26.65,25.21 26.52,25.08 26.53,25.08 | U1.6 31.22,27.77 31.22,28.89 31.35,29.02 v31.35,29.27 | U1.3 29.7,27.77 29.7,28.64 29.57,28.77 v29.32,29.27 | U1.28 29.19,30.42 29.57,30.8 v29.32,31.05 | v26.9,35.62 27.9,35.62 C10.2 27.89,35.64 27.89,36.83 29.82,36.83 C9.1 | C4.1 29.64,19.11 29.95,19.11 v29.95,18.1 29.82,17.97 | 22.43,13.11 U9.SYNC 22.28,13.26 20.58,13.26 20.58,13.46 | U9.PGND_3 19.08,11.12 | 19.69,11.12 U9.PGND_2 19.54,11.12 U9.PGND_2 | 20.6,14.17 19.99,13.56 U9.P$17 | 20.6,14.17 20.91,14.48 20.91,15.85 U9.GND | 19.99,13.41 U9.P$17 | 20.6,14.17 U9.P$17 | Q1.S_2 23.5,2.9 22.58,2.9 Q1.S_1 22.43,3.05 | 37.67,14.33 C18.2 | 34.62,33.22 v34.64,33.16 | 19.69,18.9 C22.2 | 38.74,22.71 v38.84,22.8 | 10.75,5.13 v10.75,5.33 | U5.11 10.75,6.62 10.75,6.6 8.97,6.6 8.97,7.37 8.46,7.37 8.46,7.11 7.7,7.11 7.7,6.86 v7.95,6.86 | U5.21 8.97,7.61 v8.97,6.86 | v8.97,8.13 8.97,8.38 7.95,8.38 v7.95,8.13 | 20.6,14.17 20.58,13.84 20.58,13.46 | U9.P$17 19.95,12.7 20.58,12.8 20.4,12.8 20.4,11.12 U9.PGND 20.15,11.12 U9.PGND | 16.69,42.88 U10.P$1 15.7,42.78 | C12.2 38.74,19.59 38.74,20.04 38.74,20.17 38.72,20.19 v37.52,20.19 | v37.52,20.19 v37.52,20.2 | 16.46,1.09 C15.2 | 9.36,1.14 9.36,1.09 | U10.P$3 15.7,41.48 15.7,42.16
  Top 0.152: 15.7,42.16 16.79,42.16 U10.P$2 | 15.7,42.78 15.7,42.16 | C5.1 31.7,40.45 v31.7,40.13 | C5.1 30.09,39.5 27.39,39.5 U4.A2 | R14.2 20.65,46.2 20.65,45.09 v21.16,45.09 | 29.32,24.43 C3.2 28.93,23.18 v29.32,23.18 | U3.8 34.62,19.11 34.62,19.56 36.02,19.56 U3.4 36.78,19.61 36.78,20.19 v37.52,20.19 | 37.57,20.19 v37.52,20.19 | Q7.1 Q7.2 | Q7.2 Q7.3 | Q8.1 Q8.2 Q8.3 21.92,32.84 21.92,33.53 24.34,33.53 R24.1 25.23,33.64 v25.23,36.07 | Q3.2 11.03,49.76 R25.1 11.03,49.78 v12.27,49.78 | Q4.2 11.38,45.97 R20.1 11.38,45.72 v12.53,45.72 | Q5.2 11.51,42.46 R21.1 11.51,42.42 v12.53,42.42 | Q6.2 11.38,38.8 R22.1 11.38,38.61 v12.53,38.61 | Q7.2 11.89,33.71 R23.1 11.89,32.51 v12.02,32.51 | 15.7,42.78 15.57,42.78 v15.57,43.43 | C11.2 30.09,43.78 C5.1 | U10.P$6 18.62,39.53 v18.62,38.1 | 29.39,12.7 R18.P$1 U2.2 U2.5 | 29.39,12.7 U8.4 29.46,13.03 v29.21,13.72 | v20.57,14.22 20.57,14.2 20.6,14.17 | 20.58,13.46 20.57,13.46 20.32,13.46 | 20.07,13.46 20.32,13.46 | 20.32,13.46 v20.57,13.21 22.1,13.21 | v29.21,12.19 29.46,12.7 | 29.46,12.95 29.46,12.7 | 29.39,12.7 29.46,12.7 | R17.1 35.43,6.73 v34.29,7.87 | D1.2 9.07,18.29 v11.68,18.29 | R26.2 R27.2 31.37,47.75 v30.61,48.51
  Top 0.305: C17.2 37.67,12.95 | 37.67,12.95 37.67,14.33 | 37.67,12.95 U8.2 29.46,12.95 U8.4 29.39,15.35 R16.1 | 10.75,5.13 U5.10 9.36,1.09 R5.1 R6.1 16.46,1.09 | 10.75,6.6 v10.75,5.33 | C22.2 20.92,18.81 U9.GND | 9.36,1.14 7.57,1.14 7.57,2.75 R15.1 D2.A | U9.PGND_3 18.98,9.46 19.64,9.46 | U9.PGND_2 19.64,9.46 | U9.PGND 20.27,9.46 19.64,9.46 | Q1.S_1 20.91,2.92 20.91,1.18 R7.1 C15.2 | RT1.1 11.68,12.57 v11.68,13.46 | C7.2 v11.68,16.76 | C19.2 12.76,18.29 v11.68,18.29 | C20.2 12.76,21.21 v11.81,21.21 | R10.1 20.11,7.07 v19.81,7.37
  Top 0.356: 35.54,32.32 L1.5 35.54,28.13 35.79,28.13 | 35.79,28.13 35.79,28.26 | 35.79,28.26 35.79,30.04 36.94,30.04 36.94,29.78 35.92,29.78 35.92,29.53 36.94,29.53 36.94,29.4 37.06,29.27 35.92,29.27 35.92,29.02 37.06,29.02 37.06,28.77 35.92,28.77 35.92,28.51 37.06,28.51 37.06,28.26 35.79,28.26 | 35.79,28.13 35.79,28 37.06,28
  Top 0.406: C21.CATHODE 10.04,21.53 v10.37,21.21 | C14.2 10.67,13.44 10.67,12.7 11.8,12.7 RT1.1
  Route2 0.152: v8.97,6.86 v8.97,8.13 | 12.7,8.13 v7.95,8.13 v7.95,6.86
  other vias: 34.14,26.48 34.14,24.7 34.14,22.8 35.79,22.8 35.79,24.45 35.79,26.23 34.07,28.29 34.9,27.62 36.05,27.62 37.32,27.62 37.32,29.15 37.32,30.54 38.84,30.54 38.84,29.15 38.84,27.62 38.84,26.35 38.84,24.45 37.32,26.23 37.32,24.45 37.32,22.8 34.07,32.02 35.49,32.21 19.56,14.22 19.3,13.21
  pour Top (isolate 0.356): 33.76,33.46 33.76,22.41 39.6,22.41 39.6,30.92 36.94,30.92 36.94,30.16 35.79,30.16 35.79,32.32 35.03,33.46
  pour Route2: 0,0 0,10.16 0.19,51.89 32.08,51.89 32.34,20.83 40.13,20.83 40.13,7.62 29.21,7.11 29.21,4.06 26.16,4.06 26.16,-0.25
LBO  (via drill 0.3)
  Top 0.152: 30.56,37.21 26.22,37.21 26.22,32.89 22.43,32.89 22.43,21.21 21.42,21.21 21.42,19.94 21.39,19.94 | U1.20 30.71,36.63 30.56,36.63 30.56,37.21 | 30.56,37.21 30.59,37.21 | 21.39,19.94 21.39,17.27 23.19,17.27 23.19,14.56 23.11,14.48 22.36,14.48 U9.LBO | 21.39,19.94 v20.65,19.94
LDOIN
  Top 0.305: U8.1 35.77,10.64 | U8.1 35.81,10.64 35.81,9.4 37.67,9.4 C17.1 | R11.1 35.06,9.91 U8.1
N$1  (via drill 0.3)
  Top 0.152: v35.77,8.13 R13.2
  Top 0.305: 1.86,2.67 R4.2
  Top 0.406: R4.2 1.86,10.02 JP8.1
  Bottom 0.152: v35.77,8.13 35.77,6.48 26.24,6.48 26.24,0.76 2.87,0.76 2.87,10.02 | 2.87,10.02 2.49,10.02 | 2.87,10.02 JP8.1
N$2
  Top 0.178: U1.13 34.21,30.41 L1.3
N$3
  Top 0.3: L1.1 36.19,31.32 38.33,33.46 A1.FEED
N$4
  Top 0.152: U1.1 28.71,27.27 28.55,27.11 28.05,27.11 27.79,26.86 26.65,26.86 26.14,26.35 25.89,26.35 25.25,25.72 25.25,25.13 X1.1 24.8,25.04 C2.P$2
N$5
  Top 0.152: U1.29 26.27,29.91 26.24,29.91 26.09,29.76 | 26.14,29.65 26.09,29.76 | 26.09,29.76 26.01,29.91 C6.2
N$6
  Top 0.152: U1.5 30.69,27.76 30.69,26.06 28.93,26.06 C3.1
N$7
  Top 0.152: U1.2 29.19,27.74 29.06,27.16 28.68,26.78 28.3,26.73 27.66,26.1 27.66,23.94 26.74,23.01 X1.3 26.48,22.96 C1.P$2
N$9  (via drill 0.3)
  Top 0.152: R3.1 R16.2 31.83,16.65 v31.83,17.27 | v32.21,22.73 U1.8
  Bottom 0.152: v31.83,17.27 32.85,17.27 32.85,22.35 32.21,22.35 v32.21,22.73
N$10
  Top 0.152: U1.21 30.2,33.08 29.7,33.59 29.7,34.86 29.81,34.86 C9.2
N$11
  Top 0.152: Q7.8 Q7.7 Q7.6 | JP2.5 5.67,39.46 5.67,35.05 6.99,35.05 Q7.5 Q7.6 | Q7.6 8.46,34.36 Q7.PAD
N$13
  Top 0.178: U1.12 34.21,29.91 L1.4
N$14
  Top 0.152: JP2.1 3,48.81 Q3.3
N$16
  Top 0.305: U5.12 12.39,7.1 12.39,2.79 R5.2
N$18
  Top 0.152: R6.2 13.29,2.79
  Top 0.305: U5.13 13.29,7.61 13.29,2.79
N$19  (via drill 0.3)
  Top 0.152: 5.87,6.6 U5.5 4.4,6.62 v4.4,5.97 | v13.77,12.6 12.9,12.6 RT1.2
  Route15 0.152: v4.4,5.97 9.4,6.1 13.54,6.1 v13.77,12.6
N$20
  Top 0.305: U7.V- 28.15,5.66 28.15,6.22 24.59,6.22 24.59,3.68 19.3,3.68 R7.2
N$21
  Top 0.152: 27.61,5.16 U7.BAT 27.5,5.16 | 32.49,4.57 C16.1 | 30.98,6.1 R8.1
  Top 0.305: 32.49,4.57 32.49,5.94 32.34,6.1 30.98,6.1 | R8.1 30.81,5.33 30.56,5.16 27.5,5.16
N$22
  Top 0.152: U7.COUT 25.79,5.03 25.33,5.03 25.02,4.72 25.02,3.05 Q1.G
N$23
  Top 0.152: Q2.G 30.56,2.92
  Top 0.305: 30.56,2.92 30.56,3.81 26.37,3.81 26.37,4.66 U7.DOUT
N$24
  Top 0.152: 25.02,2.13 Q1.D_2 24.93,2.29 25.73,2.29 25.73,1.68 25.02,1.68 Q1.D_1 24.87,1.68 23.96,1.68 23.8,1.83 Q1.D_5 23.65,1.98 23.7,1.98 23.7,2.29 22.53,2.29 | Q1.D_4 22.58,1.68 21.67,1.68 21.67,2.29 22.53,2.29 | 22.58,2.13 Q1.D_3 22.53,2.29 | 30.51,2.13 Q2.D_2 30.47,2.29 31.32,2.29 31.32,1.68 30.51,1.68 Q2.D_1 30.36,1.68 29.27,1.68 Q2.D_5 | 28.07,2.13 Q2.D_3 28.07,2.29 | Q2.D_5 29.14,1.98 29.29,1.98 29.29,2.29 28.07,2.29 | 29.44,1.68 29.29,1.83 Q2.D_5 | Q2.D_4 28.07,1.68 27.26,1.68 27.26,2.29 28.07,2.29
  Top 0.305: 28.07,1.68 25.02,1.68
N$25  (via drill 0.3)
  Top 0.152: 27.46,4.57 U7.VSS | 32.49,2.9 C16.2 32.64,2.74 | 29.14,2.9 Q2.S_2 | 28.22,2.9 Q2.S_1 28.07,2.9 | 34.54,2.9 34.42,2.9 34.14,2.9 34.04,2.79
  Top 0.305: v27,2.9 28.07,2.9 | 28.22,2.9 29.17,2.9 Q2.S_2 | 32.49,2.9 31.32,2.9 31.32,4.66 U7.VSS | JP1.2 37.34,2.24 37.34,2.79 34.04,2.79 32.54,2.79 C16.2 | D3.A 34.42,2.9
  Bottom 0.305: v27,2.9 37.18,2.9 JP1.2
N$26  (via drill 0.3)
  Top 0.152: Q8.8 Q8.7 | Q8.7 Q8.6 Q8.5 14.81,33.49 v14.81,34.54 | Q8.7 18.37,32.19 Q8.PAD
  Top 0.305: D4.A 14.87,32.12 14.86,32.13 16.84,32.13 Q8.7
  Bottom 0.152: v14.81,34.54 14.81,36.07 3,36.07 JP2.6
N$27
  Top 0.152: 17.55,13.11 U9.SW_2 | U9.SW_2 17.4,13.26 16.79,13.26 U9.SW_2
  Top 0.305: L2.P$1 19.51,25.76 | 15.83,13.21 U9.SW_2 | 17.55,13.11 15.83,13.11 | 17.55,12.57 U9.SW
  Top 0.61: 19.51,25.76 19.51,21.21 15.83,21.21 15.83,13.21 | 15.83,13.11 15.83,12.57 17.55,12.57
N$28  (via drill 0.3)
  Top 0.305: U9.LBI 23.45,12.55 23.45,9.27 | 22.74,8.51 23.45,8.51 23.45,9.27 | 22.74,8.51 R9.1 | v24.46,9.27 23.45,9.27 | 22.74,8.51 22.74,7.24 R10.2
N$30
  Top 0.152: R25.2 11.03,47.86 | 11.03,47.86 Q3.1 | 11.03,47.86 14.3,47.86 14.3,38.61 18.09,38.61 U10.P$5
N$31
  Top 0.152: R20.2 11.38,44.07 | 11.38,44.07 Q4.1 | 11.38,44.07 13.8,44.07 13.8,37.08 19.39,37.08 U10.P$7
N$32
  Top 0.152: R21.2 11.51,40.56 | 11.51,40.56 Q5.1 | 11.51,40.56 11.51,39.37 13.29,39.37 13.29,36.58 20.04,36.58 U10.P$8
N$33
  Top 0.152: Q6.1 11.38,36.9 R22.2 11.51,37.2 11.51,36.07 21.34,36.07 U10.P$9
N$34
  Top 0.152: JP2.2 7.52,47.08 Q4.3
N$35
  Top 0.152: JP2.3 6.68,44.54 6.68,41.66 7.6,41.66 Q5.3
N$36
  Top 0.152: JP2.4 6.18,42 6.18,38.35 7.6,38.35 Q6.3
N$37
  Top 0.152: U5.16 9.36,10.16 | U5.15 10.88,8.6
  Top 0.305: 10.88,8.6 10.88,10.16 9.36,10.16 | U5.15 12.53,8.6 12.53,8.13 U5.14 13.97,8.12 13.97,3.81 14.48,3.81 14.48,3.05 16.46,3.05 C15.1 | 16.46,2.92 C15.1 | C15.1 16.46,4.83 20.53,4.83 20.53,4.32 23.96,4.32 23.96,6.86 27.77,6.86 27.77,7.96 R8.2 32.76,7.96 34.37,6.35 34.37,4.88 34.92,4.88 | 34.92,4.88 37.18,4.88 JP1.1 | D3.C 34.67,4.62 34.92,4.88
N$38
  Top 0.152: D5.2 30.72,50.16 R26.1
N$39
  Top 0.152: D6.2 31.23,46.48 R27.1
N$40
  Top 0.152: R23.2 11.89,35.01 | 11.89,35.01 Q7.4 | 11.89,35.01 13.03,35.01 13.03,35.56 22.69,35.56 22.69,41.4 21.34,41.4 U10.P$10
N$41
  Top 0.152: Q8.4 20.91,33.49 20.91,34.8 24.34,34.8 R24.2 23.7,34.94 23.7,42.16 21.34,42.16 U10.P$11
OUT  (via drill 0.3)
  Top 0.152: U5.20 7.38,10.16 | 21.04,8.51 R9.2 20.92,8.55 | 24.97,10.64 v24.97,10.67 24.97,10.92 26,10.92 U2.1 | 20.92,10.67 U9.VBAT
  Top 0.305: 20.92,8.55 U9.VBAT | v22.3,10.67 20.92,10.67 | U5.20 7.38,11.3 5.08,11.3 5.01,11.3 5.01,8.6 U5.1 5.04,8.6 5.03,8.61
  Top 0.406: 24.97,10.64 27.18,10.64 | 27.18,10.64 27.37,10.64 | R11.2 27.91,9.91 27.18,10.64
  Top 0.61: L2.P$2 14.73,25.76 14.73,20.06 C20.1 C19.1 14.46,16.76 C7.1 14.57,15.49 | 14.57,15.49 5.08,15.49 5.08,11.3 | 21.04,8.51 14.73,8.51 14.73,15.49 14.57,15.49
  Bottom 0.305: v24.97,10.67 v22.3,10.67
RECT
  Top 0.305: U5.2 2.79,8.13 2.79,1.26 | 2.79,1.26 2.06,1.26 R4.1 | 2.79,1.26 3.48,1.26 D2.C R15.2
RST  (via drill 0.3)
  Top 0.152: 20.07,44.11 U10.P$13 20.04,44.32 22.05,44.32 | R14.1 22.05,46.31 22.05,44.32 | 22.05,44.32 v22.69,44.32 | 31.21,36.94 v31.2,36.96 31.2,35.1 31.07,35.1 31.07,34.09 31.21,34.09 U1.19
  Bottom 0.152: v22.69,44.32 23.96,44.32 23.96,37.08 31.2,37.08 v31.2,36.96
SCL  (via drill 0.3, 0.6)
  Top 0.152: U1.18 31.73,32.61 31.7,32.61 v31.7,34.54 31.7,36.55 31.88,36.55 31.88,37.59 24.46,37.59 24.46,47.12 23.57,47.12 | 18.72,44.09 U10.P$15 18.8,44.08 18.8,47.12 23.57,47.12 | v32.21,21.77 32.21,21.31 32.26,21.26 31.23,21.26 R2.P$1 33.14,21.27 33.14,20.11 U3.6 | v23.57,48.13 23.57,47.12 | U4.B2 28.78,38.97 v28.78,38.61
  Bottom 0.152: v32.21,21.77 31.07,22.28 30.38,22.96 30.38,34.54 v31.7,34.54 | v28.78,38.61 24.46,38.61 24.46,48.01 23.57,48.01 v23.57,48.13
SDA  (via drill 0.3, 0.6)
  Top 0.152: U10.P$16 18.09,49.48 21.67,49.48 | 21.67,49.48 21.67,49.53 26.24,49.53 26.24,38.99 26.99,38.99 U4.B1 27,38.97 27,37.97 32.36,37.97 v32.36,35.18 32.36,34.09 32.21,34.09 U1.17 | U3.7 32.31,19.61 32.16,19.62 | 32.16,19.62 v32.16,20.42 | R1.P$1 32.16,19.62 | v21.67,48.26 21.67,49.48
  Bottom 0.152: v32.16,20.42 29.98,21.77 29.98,25.91 30,26.49 30,35.18 30.61,35.23 30.61,35.18 v32.36,35.18
SWCLK  (via drill 0.3)
  Top 0.152: U1.31 27.43,28.91 v27.03,28.38 | v28.93,18.1 28.3,17.46 25.25,17.46 24.87,17.84 U$1.4
  Bottom 0.152: v27.03,28.38 27.92,28.26 27.92,23.68 27.79,23.56 27.79,21.4 29.06,20.13 29.06,18.22 v28.93,18.1
SWDIO  (via drill 0.3)
  Top 0.152: U1.32 27.69,28.41 27.54,27.88 27.41,27.5 v27.16,27.5 | v27.92,18.1 26.14,18.1 U$1.2
  Bottom 0.152: v27.16,27.5 27.41,27.5 27.41,21.27 28.55,20.13 28.55,18.73 v27.92,18.1
VCC  (via drill 0.3, 0.41)
  Top 0.152: 5.89,7.11 U5.4 | U5.9 8.84,5.13 | U5.17 | U5.19 7.83,10.09 7.83,11.64 7.87,11.68 8.38,11.68
  Top 0.305: 3.51,7.11 5.89,7.11 | 8.84,5.13 8.84,3.68 4.4,3.68 4.4,4.95 v5.67,4.95 3.51,4.95 3.51,7.11 | U5.3 3.51,7.61 3.51,7.11 | U5.19 7.86,11.68 7.87,11.68 8.37,11.68 | U5.18 8.37,11.68 | U5.17 8.87,11.68 8.38,11.68 8.37,11.68
  Top 0.406: 8.07,11.68 8.38,11.68 8.38,13.44 C14.1 8.07,13.46 v6.6,13.46
  Bottom 0.406: v5.67,4.95 6.6,4.95 v6.6,13.46 6.6,14.99 2.98,14.99 JP8.3
WIT  (via drill 0.3)
  Top 0.152: R17.2 R13.1 38.69,8.13 v38.69,16.38 | v31.58,23.37 31.71,23.37 U1.7
  Bottom 0.152: v38.69,16.38 37.8,16.38 37.8,19.3 33.23,19.3 33.23,22.68 32.85,22.68 32.85,23.37 v31.58,23.37

### Text on the board
tPlace: U1 | X1
tNames: 1 | SDA | SCL | 2 | 3 | GT Fierro | MP Andersen | UC Berkeley | 5/11/17 v3 | 4 | 5 | 6 | 5V | D25 | D27 | D28 | A7 | 5V | LBO | GND | +5V | +3V3 | V+ | GND | LBI | + | BAT | -